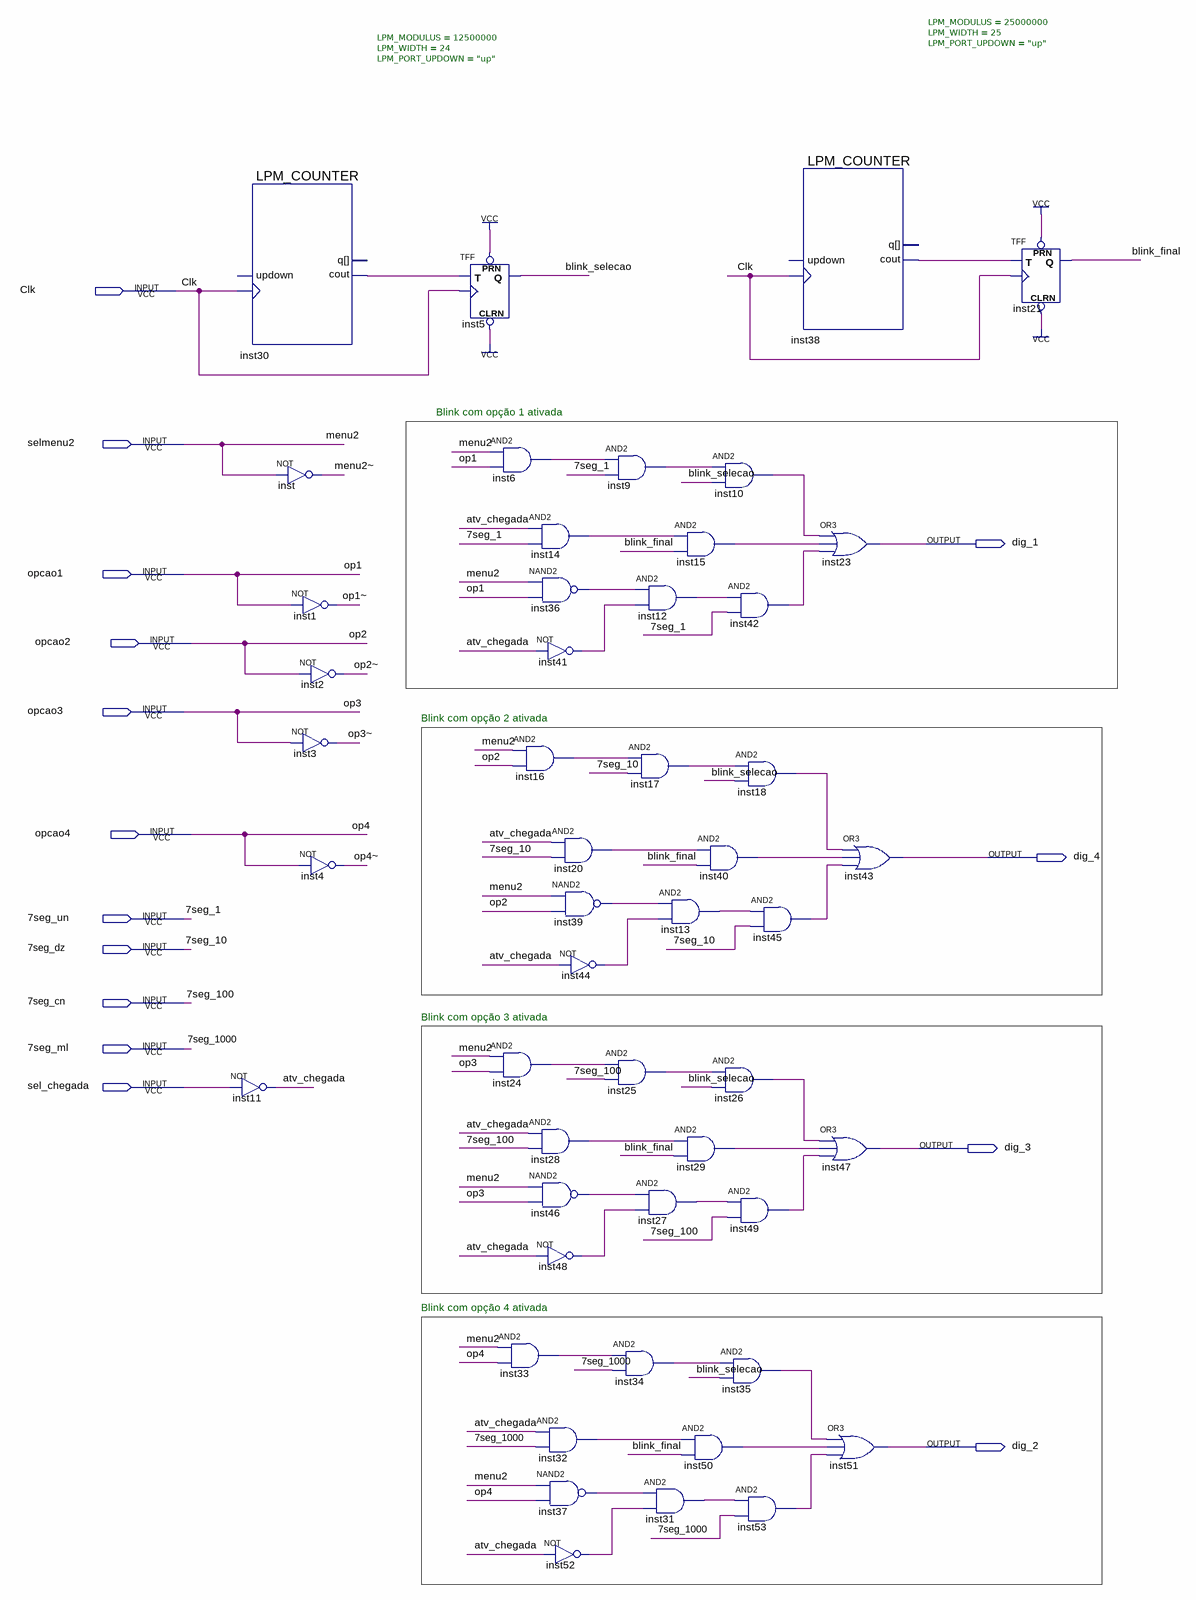
[diagram p0: schematic sheet]
// Quartus schematic Seletor_blink.bdf as structural Verilog: 50 symbols, 15 pins
module Seletor_blink (
  input  Clk,
  input  selmenu2,
  input  opcao1,
  input  opcao2,
  input  opcao3,
  input  opcao4,
  input  \7seg_un ,
  input  \7seg_dz ,
  input  \7seg_cn ,
  input  \7seg_ml ,
  input  sel_chegada,
  output dig_1,
  output dig_4,
  output dig_3,
  output dig_2
);

  wire atv_chegada, blink_final, blink_selecao, inst6_out, inst9_out, inst10_out, inst12_out, inst13_out,
       inst14_out, inst15_out, inst16_out, inst17_out, inst18_out, inst20_out, inst24_out, inst25_out,
       inst26_out, inst27_out, inst28_out, inst29_out, inst30_cout, inst31_out, inst32_out, inst33_out,
       inst34_out, inst35_out, inst36_out, inst37_out, inst38_cout, inst39_out, inst40_out, inst41_out,
       inst42_out, inst44_out, inst45_out, inst46_out, inst48_out, inst49_out, inst50_out, inst52_out,
       inst53_out, \menu2~ , \op1~ , \op2~ , \op3~ , \op4~ ;

  LPM_COUNTER #(.LPM_MODULUS(12500000), .LPM_WIDTH(24), .LPM_PORT_UPDOWN("up")) inst30 (
    .clock(Clk), .cout(inst30_cout));  // open: updown, q
  not inst11 (atv_chegada, sel_chegada);
  not inst (\menu2~ , selmenu2);
  not inst1 (\op1~ , opcao1);
  not inst2 (\op2~ , opcao2);
  not inst3 (\op3~ , opcao3);
  not inst4 (\op4~ , opcao4);
  TFF inst5 (.PRN(1'b1), .CLRN(1'b1), .T(inst30_cout), .CLK(Clk), .Q(blink_selecao));
  and inst6 (inst6_out, selmenu2, opcao1);
  and inst14 (inst14_out, atv_chegada, \7seg_un );
  nand inst36 (inst36_out, selmenu2, opcao1);
  not inst41 (inst41_out, atv_chegada);
  and inst16 (inst16_out, selmenu2, opcao2);
  and inst24 (inst24_out, selmenu2, opcao3);
  and inst28 (inst28_out, atv_chegada, \7seg_cn );
  nand inst46 (inst46_out, selmenu2, opcao3);
  not inst48 (inst48_out, atv_chegada);
  and inst33 (inst33_out, selmenu2, opcao4);
  and inst32 (inst32_out, atv_chegada, \7seg_ml );
  nand inst37 (inst37_out, selmenu2, opcao4);
  not inst52 (inst52_out, atv_chegada);
  and inst9 (inst9_out, inst6_out, \7seg_un );
  and inst20 (inst20_out, atv_chegada, \7seg_dz );
  nand inst39 (inst39_out, selmenu2, opcao2);
  not inst44 (inst44_out, atv_chegada);
  and inst25 (inst25_out, inst24_out, \7seg_cn );
  and inst12 (inst12_out, inst36_out, inst41_out);
  and inst17 (inst17_out, inst16_out, \7seg_dz );
  and inst13 (inst13_out, inst39_out, inst44_out);
  and inst27 (inst27_out, inst46_out, inst48_out);
  and inst34 (inst34_out, inst33_out, \7seg_ml );
  and inst31 (inst31_out, inst37_out, inst52_out);
  and inst10 (inst10_out, inst9_out, blink_selecao);
  and inst15 (inst15_out, inst14_out, blink_final);
  and inst42 (inst42_out, inst12_out, \7seg_un );
  and inst40 (inst40_out, inst20_out, blink_final);
  and inst26 (inst26_out, inst25_out, blink_selecao);
  and inst29 (inst29_out, inst28_out, blink_final);
  and inst49 (inst49_out, inst27_out, \7seg_cn );
  and inst35 (inst35_out, inst34_out, blink_selecao);
  and inst50 (inst50_out, inst32_out, blink_final);
  LPM_COUNTER #(.LPM_MODULUS(25000000), .LPM_WIDTH(25), .LPM_PORT_UPDOWN("up")) inst38 (
    .clock(Clk), .cout(inst38_cout));  // open: updown, q
  and inst18 (inst18_out, inst17_out, blink_selecao);
  and inst45 (inst45_out, inst13_out, \7seg_dz );
  and inst53 (inst53_out, inst31_out, \7seg_ml );
  or inst23 (dig_1, inst10_out, inst15_out, inst42_out);
  or inst43 (dig_4, inst18_out, inst40_out, inst45_out);
  or inst47 (dig_3, inst26_out, inst29_out, inst49_out);
  or inst51 (dig_2, inst35_out, inst50_out, inst53_out);
  TFF inst21 (.PRN(1'b1), .CLRN(1'b1), .T(inst38_cout), .CLK(Clk), .Q(blink_final));

  // Other names for the same wires on the sheet: 7seg_1 = \7seg_un ; 7seg_10 = \7seg_dz ; 7seg_100 = \7seg_cn ;
  //   7seg_1000 = \7seg_ml ; op1 = opcao1; op2 = opcao2; op3 = opcao3; op4 = opcao4; menu2 = selmenu2

  // Notes on the sheet:
  //   Blink com opção 1 ativada
  //   Blink com opção 2 ativada
  //   Blink com opção 3 ativada
  //   Blink com opção 4 ativada
endmodule
